# Altium schematic sheet DashNas.SchDoc
size A
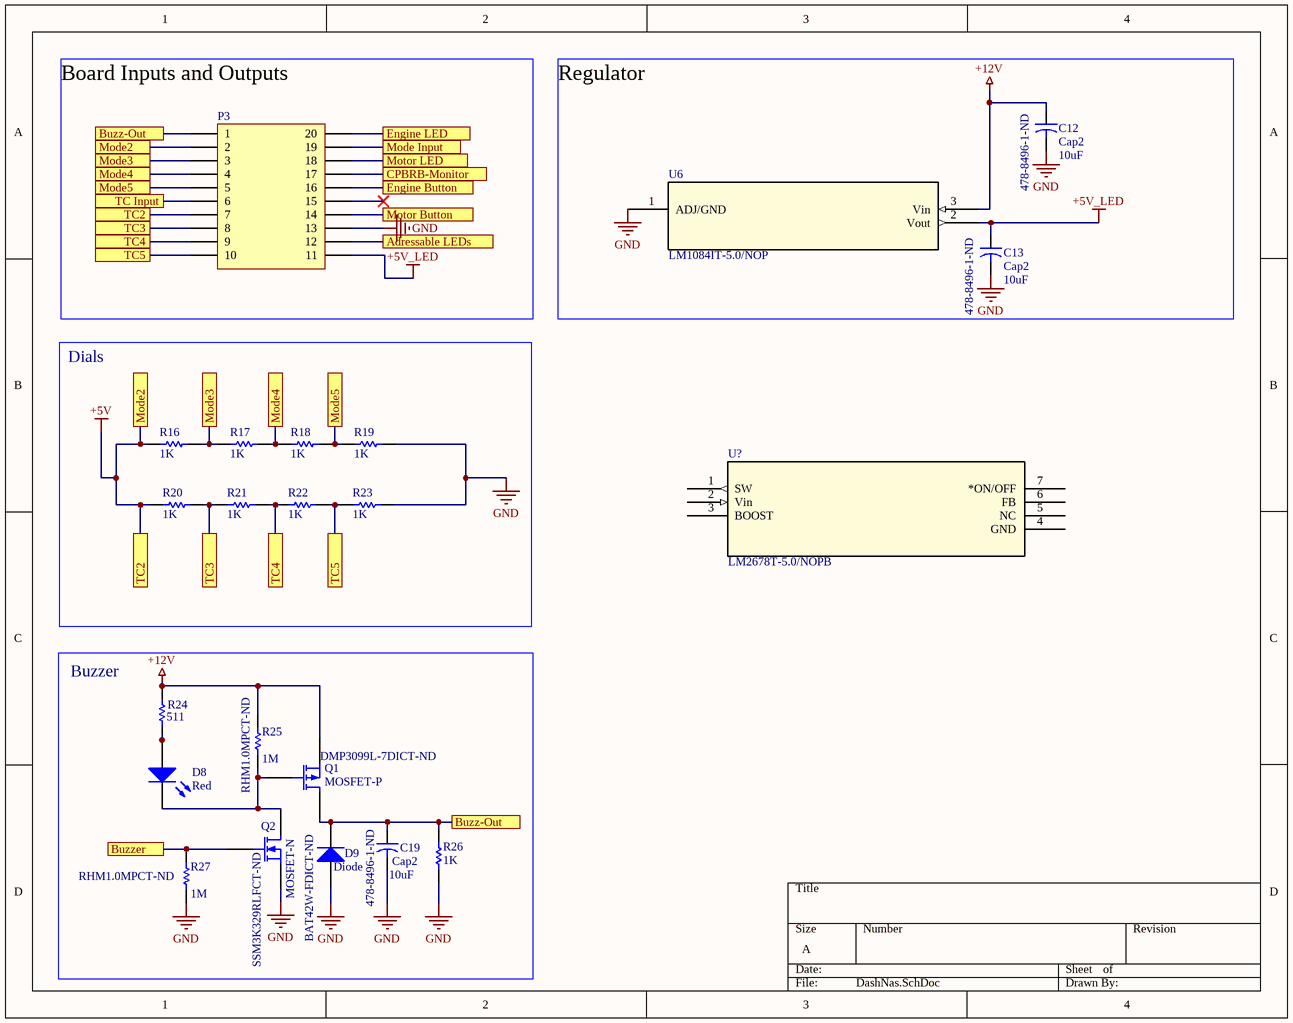
[diagram p0: DashNas.SchDoc]

## Parts
C12  Cap2  value 10uF  Supplier Part Number 1: 478-8496-1-ND  [CAPC3216X170N]
C13  Cap2  value 10uF  Supplier Part Number 1: 478-8496-1-ND  [CAPC3216X170N]
C19  Cap2  value 10uF  Supplier Part Number 1: 478-8496-1-ND  [CAPC3216X170N]
D8  Red  [LEDC3216X120NRED]
D9  Diode  Supplier Part Number: BAT42W-FDICT-ND  [SOD123]
P3  (no value)  [MX150 20 PIN]
Q1  MOSFET-P  Supplier Part Number: DMP3099L-7DICT-ND  [SOT23-3]
Q2  MOSFET-N  Supplier Part Number: SSM3K329RLFCT-ND  [SOT23-3]
R16  1K  [RESC3216X60N]
R17  1K  [RESC3216X60N]
R18  1K  [RESC3216X60N]
R19  1K  [RESC3216X60N]
R20  1K  [RESC3216X60N]
R21  1K  [RESC3216X60N]
R22  1K  [RESC3216X60N]
R23  1K  [RESC3216X60N]
R24  511  [RESC3216X60N]
R25  value 1M  Supplier Part Number 1: RHM1.0MPCT-ND  [RESC3216X60N]  (hidden comment: 1206)
R26  1K  [RESC3216X60N]
R27  value 1M  Supplier Part Number 1: RHM1.0MPCT-ND  [RESC3216X60N]  (hidden comment: 1206)
U6  LM1084IT-5.0/NOP  [T03B]
U?  LM2678T-5.0/NOPB  [TA07B]

## Ports
Adressable LEDs, Buzz-Out, Buzzer, CPBRB-Monitor, Engine Button, Engine LED, Mode2, Mode3, Mode4, Mode5, Mode Input, Motor Button, Motor LED, TC2, TC3, TC4, TC5, TC Input

## Nets
+5V: P3.2 P3.7 R16.1 R20.1 ; port Mode2, port TC2
+5V_LED: C13.1 P3.11 U6.2(Vout)
+12V: C12.1 Q1.3(S) R24.1 R25.2 U6.3(Vin)
GND: C12.2 C13.2 C19.2 D9.1(A) P3.13 Q2.3(S) R19.2 R23.2 R26.1 R27.1 U6.1(ADJ/GND)
Adressable LEDs: P3.12 ; port Adressable LEDs
Buzz-Out: C19.1 D9.2(K) P3.1 Q1.1(D) R26.2 ; port Buzz-Out
Buzzer: Q2.2(G) R27.2 ; port Buzzer
CPBRB-Monitor: P3.17 ; port CPBRB-Monitor
Engine Button: P3.16 ; port Engine Button
Engine LED: P3.20 ; port Engine LED
Mode3: P3.3 R16.2 R17.1 ; port Mode3
Mode4: P3.4 R17.2 R18.1 ; port Mode4
Mode5: P3.5 R18.2 R19.1 ; port Mode5
Mode Input: P3.19 ; port Mode Input
Motor Button: P3.14 ; port Motor Button
Motor LED: P3.18 ; port Motor LED
TC3: P3.8 R20.2 R21.1 ; port TC3
TC4: P3.9 R21.2 R22.1 ; port TC4
TC5: P3.10 R22.2 R23.1 ; port TC5
TC Input: P3.6 ; port TC Input
NetD8_1: D8.1(A) R24.2
NetD8_2: D8.2(K) Q1.2(G) Q2.1(D) R25.1

Not connected (* = marked no-connect by the designer): P3 15*; U? 1(SW) 2(Vin) 3(BOOST) 4(GND) 5(NC) 6(FB) 7(*ON/OFF)

## Notes on the sheet
- (near P3) Board Inputs and Outputs
- Dials
- Regulator
- (near R24) Buzzer

## Library data of the parts
C12 C13 C19 = Cap2: Capacitor. Ceramic 10uF 50V rating recommended, place close to pin; Published: 23-Sep-2002; PackageReference: CAPR5-4X5; Publisher: Altium Limited; PackageDescription: Capacitor; 2 Leads; Supplier 1: Digi-Key
D8 = LED2: Typical RED, GREEN, YELLOW, AMBER GaAs LED; Manufacturer: Broadcom Avago; Manufacturer Part Number: HSMY-C150; Lens Colour: White,Clear; Viewing Angle: 170°; Lens Style: Diffused,Colorless,Rectangular; Wavelength: 586nm; Luminous Intensity: 8mcd; Forward Current: 20mA; Forward Voltage: 2.1V; Number of LEDs: 1; Reverse Voltage: 5V; Power Dissipation: 65mW; Lens Transparency: Diffused; Published: 8-Jun-2000; LatestRevisionDate: 17-Jul-2002; LatestRevisionNote: Re-released for DXP Platform.; PackageVersion: Feb-2002; PackageReference: 3.2X1.6X1.1; Publisher: Altium Limited; PackageDescription: SM LED; 2 Flat Leads; Supplier 1: Digi-Key; Stock 1: 0; Mount: Surface Mount; Case/Package: 1206; Number of Pins: 2; Colour: Yellow; Case Code (Metric): 3216; Case Code (Imperial): 1206; Contact Plating: Gold; Min Operating Temperature: -40°C; Max Operating Temperature: 85°C; Packaging: Tape and Reel; Package Quantity: 1; Illumination Colour: Yellow; Dominant Wavelength: 586nm; Test Current: 20mA; Number of Elements: 1; Power Rating: 65mW; Max Power Dissipation: 65mW; Voltage Rating (DC): 2.1V; Length: 3.2mm; Height: 1.1mm; Width: 1.6mm; Depth: 1.6mm; Radiation Hardening: No; REACH SVHC: No SVHC; Lead Free: Lead Free; ComponentLink1URL: https://datasheet.ciiva.com/15117/getdatasheetpartid-110528-15117488.pdf; ComponentLink1Description: https://datasheet.ciiva.com/15117/getdatasheetpartid-110528-15117488.pdf; ComponentLink2URL: https://datasheet.ciiva.com/11774/0900766b804a6539-11774578.pdf; ComponentLink2Description: https://datasheet.ciiva.com/11774/0900766b804a6539-11774578.pdf; ComponentLink3URL: https://datasheet.ciiva.com/19466/1557071-19466435.pdf; ComponentLink3Description: https://datasheet.ciiva.com/19466/1557071-19466435.pdf; ComponentLink4URL: https://datasheet.ciiva.com/14172/swseriehsmx-c150toc190-e-14172159.pdf; ComponentLink4Description: https://datasheet.ciiva.com/14172/swseriehsmx-c150toc190-e-14172159.pdf; ComponentLink5URL: https://datasheet.ciiva.com/29280/180507-da-01-en-chip-led-hsmy-c150-gelb-29280997.pdf; ComponentLink5Description: https://datasheet.ciiva.com/29280/180507-da-01-en-chip-led-hsmy-c150-gelb-29280997.pdf; Supplier 2: Digi-Key; Stock 2: 0; ComponentLink6URL: https://datasheet.ciiva.com/11773/0900766b804a6539-11773956.pdf; ComponentLink6Description: https://datasheet.ciiva.com/11773/0900766b804a6539-11773956.pdf; ComponentLink7URL: https://datasheet.ciiva.com/15117/getdatasheetpartid-142358-15117749.pdf; ComponentLink7Description: https://datasheet.ciiva.com/15117/getdatasheetpartid-142358-15117749.pdf; ComponentLink8URL: https://datasheet.ciiva.com/46426/313031-46426533.pdf; ComponentLink8Description: https://datasheet.ciiva.com/46426/313031-46426533.pdf; ComponentLink9URL: https://datasheet.ciiva.com/14172/swseriehsmx-c150toc190-e-14172156.pdf; ComponentLink9Description: https://datasheet.ciiva.com/14172/swseriehsmx-c150toc190-e-14172156.pdf; ComponentLink10URL: https://datasheet.ciiva.com/29281/180509-da-01-en-chip-led-hsmh-c150-rot-29281009.pdf; ComponentLink10Description: https://datasheet.ciiva.com/29281/180509-da-01-en-chip-led-hsmh-c150-rot-29281009.pdf; Supplier 3: Digi-Key; Supplier 4: Digi-Key; Supplier Part Number: 732-4992-1-ND
D9 = Diode: Default Diode; Published: 8-Jun-2000; LatestRevisionDate: 17-Jul-2002; LatestRevisionNote: Re-released for DXP Platform.; PackageVersion: Sep-1996; PackageReference: SMC; Publisher: Altium Limited; PackageDescription: DO-214-AB/SMC; 2 C-Bend Leads; Body 7.9 x 5.9 mm, inc. leads (LxW); Code_JEDEC: DO-214-AB; Supplier 1: Digi-Key
P3 = 10x2 Pin Connector: Capacitor; Published: 8-Jun-2000; LatestRevisionDate: 17-Jul-2002; LatestRevisionNote: Re-released for DXP Platform.; PackageReference: RAD-0.3; Publisher: Altium Limited; PackageDescription: Radial Cap, Thru-Hole; 2 Leads; 0.3 in Pin Spacing; Supplier Part Number: *
Q1 = MOSFET-P: P-Channel MOSFET; pin to pad: 1>3 2>1 3>2; Published: 8-Jun-2000; LatestRevisionDate: 17-Jul-2002; LatestRevisionNote: Re-released for DXP Platform.; PackageVersion: 1995/1996; PackageReference: E3; Publisher: Altium Limited; PackageDescription: TO, Flat Index; 3 In-Line, Axial Leads; Body Dia. 4.6mm; Lead Dia. 0.5 mm (max); Supplier 1: Digi-Key
Q2 = MOSFET-N: N-Channel MOSFET; pin to pad: 1>3 2>1 3>2; Published: 8-Jun-2000; LatestRevisionDate: 17-Jul-2002; LatestRevisionNote: Re-released for DXP Platform.; PackageVersion: 1995/1996; PackageReference: E3; Publisher: Altium Limited; PackageDescription: TO, Flat Index; 3 In-Line, Axial Leads; Body Dia. 4.6mm; Lead Dia. 0.5 mm (max); Supplier 1: Digi-Key
R16-R23 R26 = Res1: Resistor; Manufacturer: Stackpole Electronics; Manufacturer Part Number: RNCP1206FTD1K00; Resistance: 1kR; Tolerance: 1%; Temperature Coefficient: 100ppm/°C; Max Power Dissipation: 500mW; Value: 1K; Supplier Part Number: RMCF1206FT1K00CT-ND; Supplier 1: Digi-Key; Stock 1: 679; Pricing 1: 1=0.1, 10=0.052, 100=0.0211, 1000=0.00949, 2500=0.00824 (USD); Mount: Surface Mount; Case/Package: 1206; Case Code (Metric): 3216; Case Code (Imperial): 1206; Contact Plating: Nickel,Tin,Matte; Min Operating Temperature: -55°C; Max Operating Temperature: 155°C; Packaging: Tape and Reel; Composition: Thin Film; Number of Terminations: 2; Length: 0.122inch; Height: 0.024inch; Width: 0.059inch; Radiation Hardening: No; Lead Free: Lead Free; ComponentLink1URL: http://www.seielect.com/Catalog/SEI-rncp.pdf; ComponentLink1Description: http://www.seielect.com/Catalog/SEI-rncp.pdf; ComponentLink2URL: https://www.seielect.com/catalog/SEI-Packaging.pdf; ComponentLink2Description: https://www.seielect.com/catalog/SEI-Packaging.pdf
R24 R25 R27 = Res1: Resistor; Published: 8-Jun-2000; LatestRevisionDate: 17-Jul-2002; LatestRevisionNote: Re-released for DXP Platform.; PackageReference: AXIAL-0.3; Publisher: Altium Limited; PackageDescription: Axial Device, Thru-Hole; 2 Leads; 0.3 in Pin Spacing; Supplier 1: Digi-Key
  R24: Value: 511; Supplier Part Number 1: RNCP1206FTD511RCT-ND
U6 = LM1084IT-5.0/NOP: Imported; Manufacturer_Part_Number: LM1084IT-5.0/NOPB; Vendor: Texas Instruments; Built_By: EMA_UL_Team; C: Copyright (C) 2015 Accelerated Designs. All rights reserved; RefDes: RefDes; Type: DEV; Value: Value; Supplier Part Number: LM1084IT-5.0/NOPB-ND
U? = LM2678T-5.0/NOPB: Imported; Vendor: Texas Instruments; Built_By: EMA_UL_Team; C: Copyright (C) 2015 Accelerated Designs. All rights reserved; Manufacturer_Part_Number: LM2678T-5.0/NOPB; RefDes: RefDes; Type: DEV; Value: Value